# Altium schematic sheet Proyecto_SumoBot_V1.SchDoc
size Letter; Organization: Altium Limited; Address1: L3, 12a Rodborough Rd; Address2: Frenchs Forest; Address3: NSW; Address4: Australia 2086; SheetNumber: 5; SheetTotal: 5
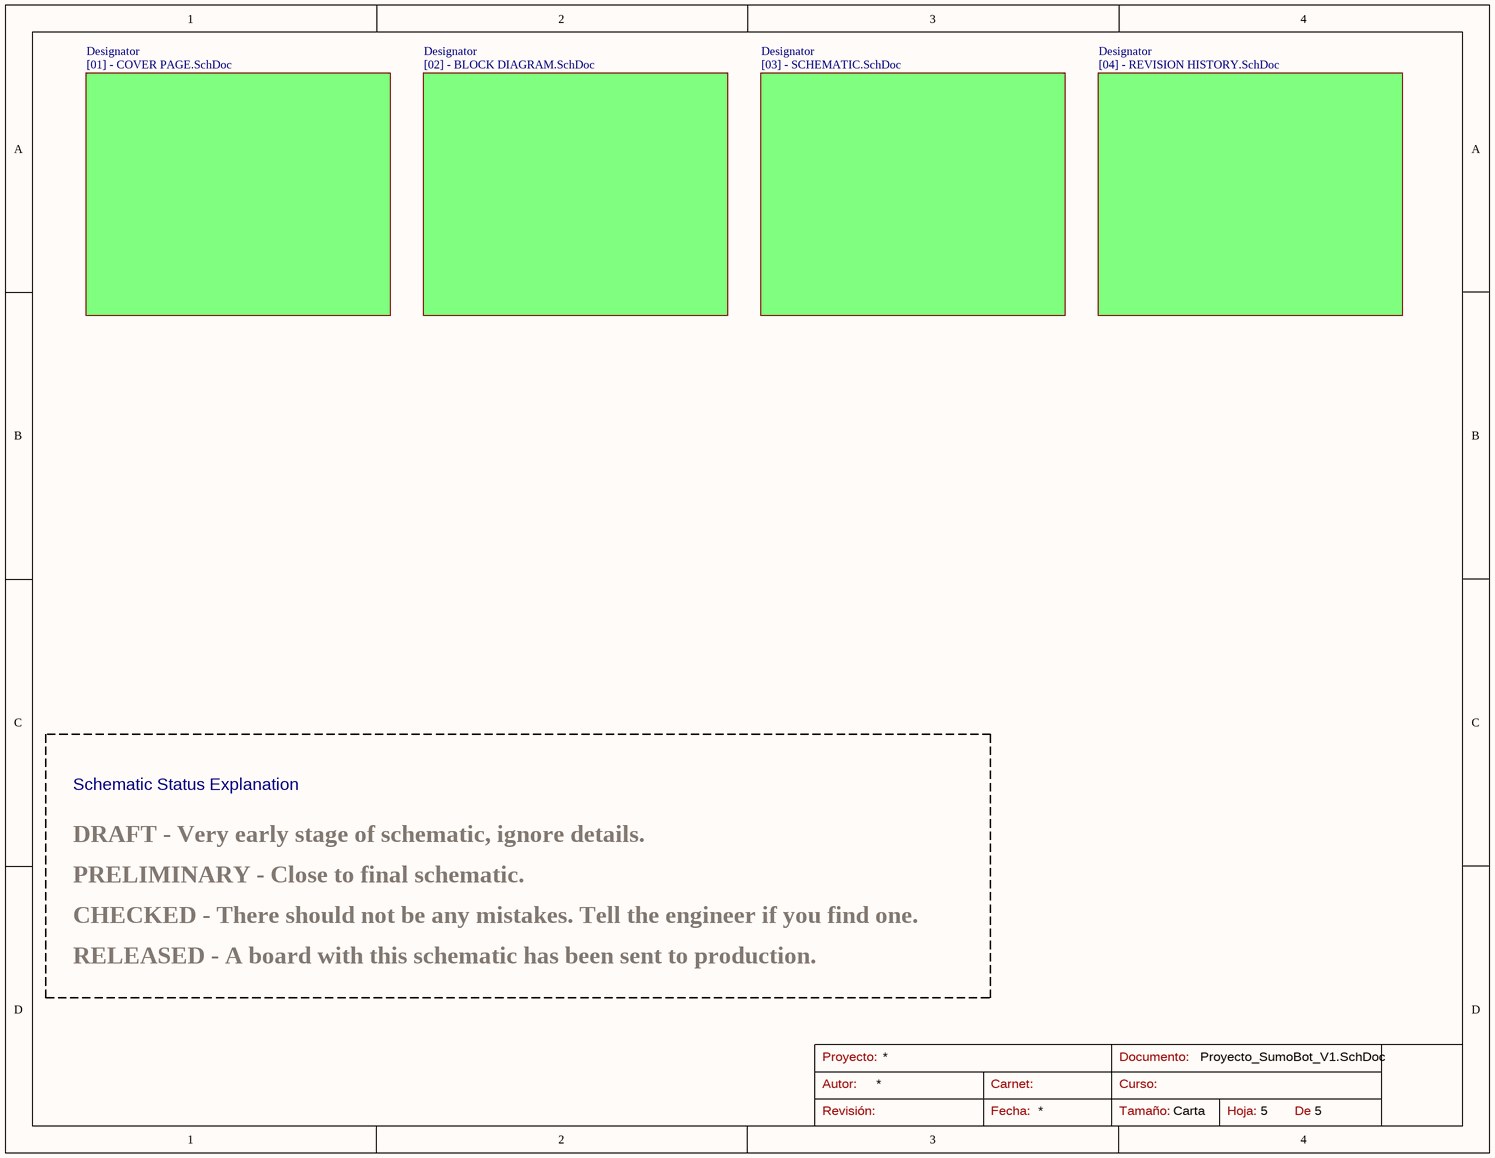
[diagram p0: Proyecto_SumoBot_V1.SchDoc]

## Sub-sheets
Designator = [02] - BLOCK DIAGRAM.SchDoc: no entries
Designator = [01] - COVER PAGE.SchDoc: no entries
Designator = [03] - SCHEMATIC.SchDoc: no entries
Designator = [04] - REVISION HISTORY.SchDoc: no entries

## Notes on the sheet
- Schematic Status Explanation
- PRELIMINARY - Close to final schematic.
- DRAFT - Very early stage of schematic, ignore details.
- RELEASED - A board with this schematic has been sent to production.
- CHECKED - There should not be any mistakes. Tell the engineer if you find one.
- Proyecto:
- Autor:
- Carnet:
- Documento:
- Curso:
- Revisión:
- Fecha:
- Tamaño:
- Carta
- Hoja:
- De